# EAGLE design tvbgone (EAGLE 7.3.0)
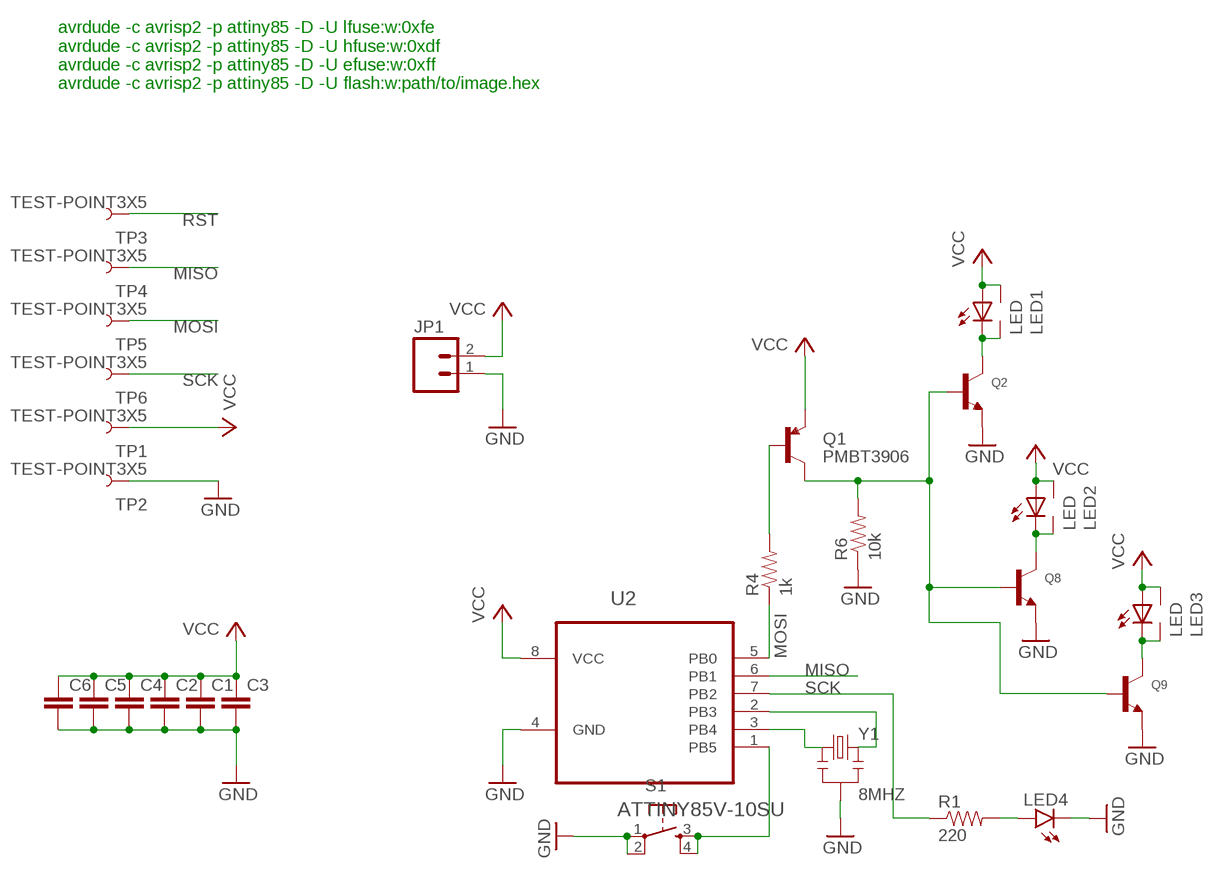
[diagram p0: schematic, sheet 1]

## Parts
C1  CAP0603-CAP  [0603-CAP]
C2  CAP0603-CAP  [0603-CAP]
C3  CAP0603-CAP  [0603-CAP]
C4  CAP0603-CAP  [0603-CAP]
C5  CAP0603-CAP  [0603-CAP]
C6  CAP0603-CAP  [0603-CAP]
JP1  M02LOCK  [1X02_LOCK]
LED1  LED  [5MM-SIDE]
LED2  LED  [5MM-SIDE]
LED3  LED  [5MM-SIDE]
LED4  LED0603  [LED-0603]
Q1  PMBT3906  TRANSISTOR_PNPPMBT3906  [SOT23-3]
Q2  TRANSISTOR_NPN  [SOT-23-R]
Q8  TRANSISTOR_NPN  [SOT-23-R]
Q9  TRANSISTOR_NPN  [SOT-23-R]
R1  220  RESISTOR0603  [0603-RES]
R4  1k  RESISTOR0603  [0603-RES]
R6  10k  RESISTOR0603  [0603-RES]
S1  TAC_SWITCHSMD  [TACTILE-SWITCH-SMD]
TP1  TEST-POINT3X5  [PAD.03X.05]
TP2  TEST-POINT3X5  [PAD.03X.05]
TP3  TEST-POINT3X5  [PAD.03X.05]
TP4  TEST-POINT3X5  [PAD.03X.05]
TP5  TEST-POINT3X5  [PAD.03X.05]
TP6  TEST-POINT3X5  [PAD.03X.05]
U2  ATTINY85V-10SU  [SOIC127P798X216-8N]
Y1  8MHZ  RESONATOR8MHZ  [RESONATOR-SMD]

## Nets
GND: C1.2 C2.2 C3.2 C4.2 C5.2 C6.2 JP1.1 LED4.C Q2.3-EMITTER(E) Q8.3-EMITTER(E) Q9.3-EMITTER(E) R6.1 S1.1 S1.2 TP2.P$1 U2.4(GND) Y1.2
MISO: TP4.P$1 U2.6(PB1)
MOSI: R4.1 TP5.P$1 U2.5(PB0)
N$1: U2.3(PB4) Y1.1
N$2: U2.2(PB3) Y1.3
N$3: LED4.A R1.2
N$4: LED1.K2(C1) LED1.K(C) Q2.2-COLLECTOR(C)
N$5: LED2.K2(C1) LED2.K(C) Q8.2-COLLECTOR(C)
N$6: Q1.1(B) R4.2
N$7: LED3.K2(C1) LED3.K(C) Q9.2-COLLECTOR(C)
N$10: Q1.3(C) Q2.1-BASE(B) Q8.1-BASE(B) Q9.1-BASE(B) R6.2
RST: S1.3 S1.4 TP3.P$1 U2.1(PB5)
SCK: R1.1 TP6.P$1 U2.7(PB2)
VCC: C1.1 C2.1 C3.1 C4.1 C5.1 C6.1 JP1.2 LED1.A LED1.A2(A1) LED2.A LED2.A2(A1) LED3.A LED3.A2(A1) Q1.2(E) TP1.P$1 U2.8(VCC)

## Notes on the sheet
- avrdude -c avrisp2 -p attiny85 -D -U lfuse:w:0xfe
  avrdude -c avrisp2 -p attiny85 -D -U hfuse:w:0xdf
  avrdude -c avrisp2 -p attiny85 -D -U efuse:w:0xff
  avrdude -c avrisp2 -p attiny85 -D -U flash:w:path/to/image.hex

## Library data of the parts
C1-C6 = homemade-hardware:CAP: Capacitor Standard 0603 ceramic capacitor, and 0.1" leaded capacitor.
JP1 = SparkFun:M02: Header 2 Standard 2-pin 0.1" header. Use with straight break away headers (SKU : PRT-00116), right angle break away headers (PRT-00553), swiss pins (PRT-00743), machine pins (PRT-00117), and female headers (PRT-00115). Molex polarized connector foot print use with SKU : PRT-08233 with associated crimp pins and housings.
LED1-LED3 = tvbgone:LED
LED4 = homemade-hardware:LED: LEDs Standard schematic elements and footprints for 5mm, 3mm, 1206, and 0603 sized LEDs. 5mm - Spark Fun Electronics SKU : COM-00529 (and others)
Q1 = SparkFun-DiscreteSemi:TRANSISTOR_PNP: Generic PNP BJT Double check pinouts against datasheets- not all devices are the same! MMBT3906 - 40V 200mA SOT-23 (TRANS-08052) MMBT4403 - 40V 600mA SOT-23 (TRANS-09245); PROD_ID: TRANS-08052
Q2 Q8 Q9 = Tomorrow_Lab_LLC:TRANSISTOR_NPN: NPN Transistor Transistor (NPN) 500mA 45V - BC817 [Digikey: 568-1631-1-ND] SOT23-R - SOT23 footprint optimised for use with solder paste and reflow ovens. SOT23-W - SOT23 footprint optimised for hand-soldering (larger pads).
R1 R4 R6 = homemade-hardware:RESISTOR: Resistor Basic schematic elements and footprints for 0603, 1206, and PTH resistors.
S1 = SparkFun-Electromechanical:TAC_SWITCH: Momentary Switch Button commonly used for reset or general input. Spark Fun Electronics SKU : COM-00097 SMT- SWCH-08247
TP1-TP6 = SparkFun-Passives:TEST-POINT: Bare copper test points for troubleshooting or ICT
U2 = Atmel_By_element14_Batch_1:ATTINY85V-10SU: 8-bit Microcontroller with In-System Programmable Flash; MPN: ATTINY85V-10SU; OC_FARNELL: 1455166; OC_NEWARK: 58M3799; PACKAGE: SOIC-8; SUPPLIER: Atmel
Y1 = homemade-hardware:RESONATOR: Resonator Small SMD resonator. Used, eg, on the Arduino Pro/ Pro Mini boards. 8MHz- XTAL-08895 16MHz- XTAL-08900; PROD_ID: XTAL-08895

## Board
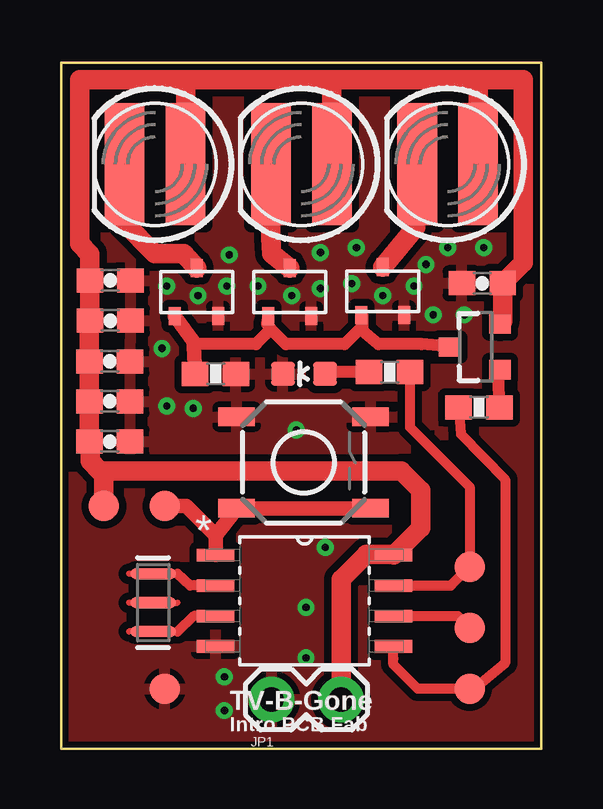
[diagram p1: board, top side]
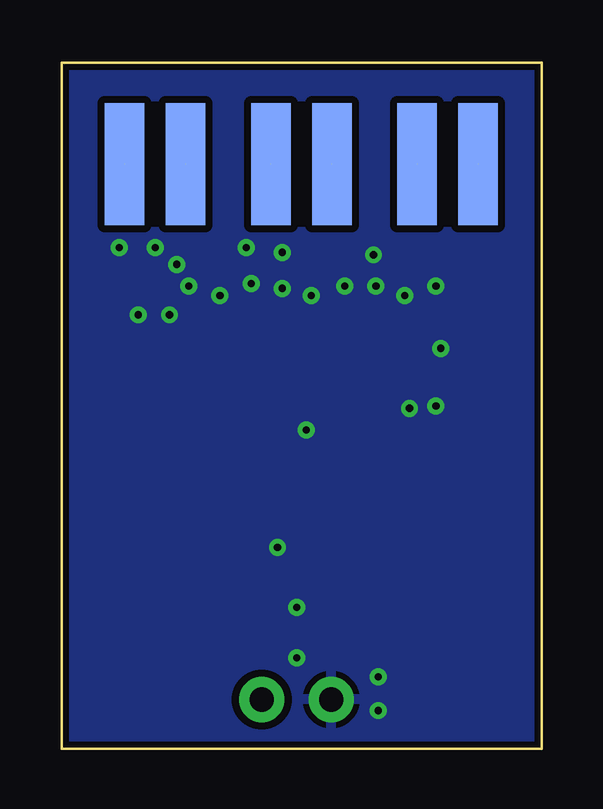
[diagram p2: board, bottom side, seen from below]

Size 20 x 28.6 mm. Coordinates in mm from the lower left corner, seen from the top.
Outline: 20,0 20,28.6 0,28.6 0,0 20,0
Copper layers (1*16): Top 0.035mm / dielectric 1.5mm / Bottom 0.035mm
Design rules "default *": minimum track width 10mil, minimum drill 20mil, track to track 12mil, track to pad 12mil, pad to pad 12mil, via to via 12mil, smd to smd 0mil, copper to edge 10mil, drill to drill 8mil, minimum pad ring 10mil, minimum via ring 8mil, stop-mask expansion 4mil, vias tented up to drill 20mil, thermal gap 10mil

### Footprints (pad centres in the part's own frame; a part is rotated, then mirrored left to right if it is on the bottom)
0603-CAP = smd 1.1 x 1: 1 -0.85,0; 2 0.85,0
1X02_LOCK = drill 1.016 pad 1.88: 1 -0.178,0; 2 2.718,0
5MM-SIDE = smd 1.651 x 5.08: A -1.27,0; K 1.27,0 | smd 1.651 x 5.08 bottom: A2 -1.27,0; K2 1.27,0
LED-0603 = smd 1 x 1: A 0,-0.877; C 0,0.877
SOT23-3 = smd 0.8 x 0.9: 1 -0.95,-1; 2 0.95,-1; 3 0,1.1
SOT-23-R = smd 0.5 x 0.75: 1-BASE -0.9,-1; 2-COLLECTOR 0,1; 3-EMITTER 0.9,-1
0603-RES = smd 1.1 x 1: 1 -0.85,0; 2 0.85,0
TACTILE-SWITCH-SMD = smd 1.524 x 0.762: 1 -2.794,1.905; 2 2.794,1.905; 3 -2.794,-1.905; 4 2.794,-1.905
PAD.03X.05 = smd 1.27 x 1.27: P$1 0,0
SOIC127P798X216-8N = smd 1.549 x 0.533: 1 -3.708,1.905; 2 -3.708,0.635; 3 -3.708,-0.635; 4 -3.708,-1.905; 5 3.708,-1.905; 6 3.708,-0.635; 7 3.708,0.635; 8 3.708,1.905
RESONATOR-SMD = smd 0.45 x 1.905: 1 -1.2,0; 2 0,0; 3 1.2,0

### Placement (x,y rotation side)
C1  2.02,14.49 0 top
C2  2.02,16.16 0 top
C3  2.02,12.82 0 top
C4  17.55,19.41 180 top
C5  2.04,19.53 0 top
C6  2.04,17.86 0 top
JP1  8.94,2.06 0 top
LED1  16.1,24.37 180 top
LED2  3.91,24.37 180 top
LED3  10.01,24.37 180 top
LED4  10.12,15.64 90 top
Q1  17.28,16.76 90 top
Q2  13.39,19.08 0 top
Q8  5.64,19.05 0 top
Q9  9.52,19.05 0 top
R1  13.68,15.71 180 top
R4  17.41,14.24 0 top
R6  6.43,15.64 180 top
S1  10.1,11.94 0 top
TP1  1.78,10.13 0 top
TP2  4.32,2.51 0 top
TP3  4.32,10.13 0 top
TP4  17.02,5.05 0 top
TP5  17.02,2.51 0 top
TP6  17.02,7.59 0 top
U2  10.14,6.18 0 top
Y1  3.83,6.1 90 top

### Tracks (layer width: path | path; a pad name or v marks a point on that pad's centre or on a via)
GND  (via drill 0.3)
  other vias: 7,20.6 8.2,19.3 12.3,20.9 10.8,20.7 12.1,19.4 14.7,19.3 10.8,19.2 6.9,19.3 4.4,19.3 17.6,20.9 16.1,20.9 15.5,18.1 16.8,18.1 4.2,16.7 5.5,14.2 9.8,13.3 10.2,3.8 11,8.4 10.2,5.9 6.8,1.6 6.8,3 5.7,18.9 9.6,18.9 13.4,18.9 15.2,20.2 4.4,14.3
  pour Top (isolate 0.2): -1.67,29.28 21.19,29.28 21.19,-0.77 -1.67,-0.77
  pour Bottom: -1,29 21,29 21,-1 -1,-1
MISO
  Top 0.406: U2.6 16.52,5.54 TP4.P$1
MOSI
  Top 0.406: U2.5 13.84,3.76 13.84,3.52 14.86,2.51 TP5.P$1 17.53,2.76 18.49,3.58 18.49,11.23 16.65,13.12 R4.1
N$1
  Top 0.406: U2.3 5.53,5.54 4.85,4.9
N$2
  Top 0.406: U2.2 5.37,6.81 4.85,7.3
N$3
  Top 0.5: R1.2 11.06,15.71 LED4.A
N$4  (1 unrouted)
  Top 0.813: LED1.K2 14.77,21.75 Q2.2-COLLECTOR
N$5  (1 unrouted)
  Top 0.813: LED2.K2 2.64,21.92 3.9,20.66 5.09,20.66 Q8.2-COLLECTOR
N$6
  Top 0.406: 18.22,15.59 Q1.1
  Top 0.5: R4.2 18.22,15.59
N$7  (1 unrouted)
  Top 0.813: LED3.K2 8.74,21.3 8.78,20.66 Q9.2-COLLECTOR
N$10
  Top 0.5: Q9.1-BASE 8.57,17.73 8.74,17.5 | 8.74,17.5 8.11,16.88 5.59,16.88 | Q1.3 15.01,16.88 13.21,16.88 12.56,17.43 12.56,18.06 Q2.1-BASE 12.54,17.61 11.81,16.88 9.36,16.88 8.74,17.5
  Top 0.61: Q8.1-BASE 5.59,16.88 5.53,16.79 R6.2
RST
  Top 0.61: S1.4 S1.3 6.43,8.91 | U2.1 6.43,8.91 | TP3.P$1 5.21,10.13 6.43,8.91
SCK
  Top 0.406: U2.7 16.24,6.81 TP6.P$1 17.02,10.93 14.53,13.41 R1.1
VCC  (3 unrouted)
  Top 0.813: 17.37,27.91 11.28,27.91 | 11.28,27.91 5.18,27.91 | LED2.A2 5.18,27.91 | LED3.A 11.28,27.91 | LED1.A 17.37,27.91 | 5.18,27.91 5.17,27.91 0.76,27.91 0.76,21.07 1.19,20.64 C5.1 C6.1 1.17,17.84 C2.1 C1.1 C3.1 1.2,12.79 1.2,12 1.6,11.6 1.8,11.6 | 1.8,11.6 14.17,11.6 14.99,10.78 14.99,9.22 U2.8 13.83,8.1 12.7,8.1 11.66,7.06 JP1.2 | 17.37,27.91 19.25,27.91 19.25,20.27 C4.1 18.4,17.83 Q1.2 | TP1.P$1 1.78,11.57 1.8,11.6

### Text on the board
tNames: TV-B-Gone | Intro PCB Fab